# Altium schematic sheet Sch_Phy.SchDoc
size A4; ENG_APP_DATE: --/--/--; DSN_APP_DATE: --/--/--; CHK_APP_DATE: --/--/--; CompanyName: Universidade Federal de Santa Maria; Organization: Universidade Federal de Santa Maria; Address1: Av. Roraima 1000; Address2: Camobi; Address3: Santa Maria - RS; Address4: Brasil; SheetNumber: 4; SheetTotal: 6
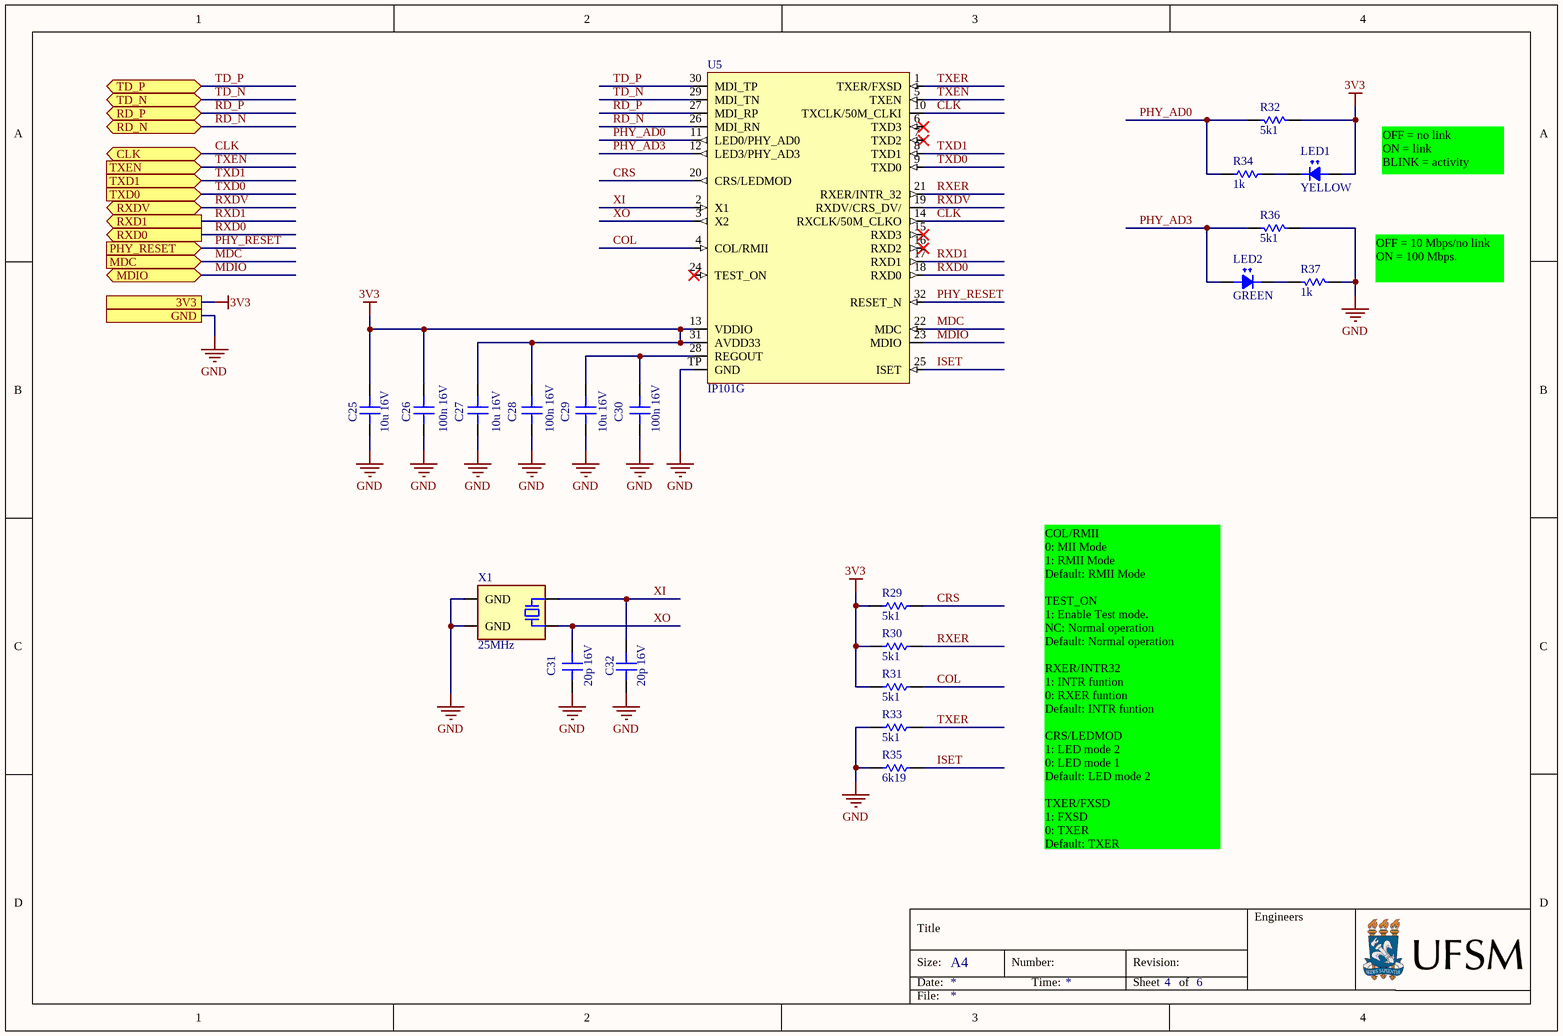
[diagram p0: Sch_Phy.SchDoc]

## Parts
C25  10u 16V  [CAP_SMD_0603]
C26  100n 16V  [CAP_SMD_0603]
C27  10u 16V  [CAP_SMD_0603]
C28  100n 16V  [CAP_SMD_0603]
C29  10u 16V  [CAP_SMD_0603]
C30  100n 16V  [CAP_SMD_0603]
C31  20p 16V  [CAP_SMD_0603]
C32  20p 16V  [CAP_SMD_0603]
LED1  YELLOW  [LED_SMD_0603]
LED2  GREEN  [LED_SMD_0603]
R29  5k1  [RES_SMD_0603]
R30  5k1  [RES_SMD_0603]
R31  5k1  [RES_SMD_0603]
R32  5k1  [RES_SMD_0603]
R33  5k1  [RES_SMD_0603]
R34  1k  [RES_SMD_0603]
R35  6k19  [RES_SMD_0603]
R36  5k1  [RES_SMD_0603]
R37  1k  [RES_SMD_0603]
U5  IP101G  [IC_QFN32_4x4]
X1  25MHz  [XTAL_SMD_3525]

## Ports
3V3, CLK (bidir), GND, MDC (in), MDIO (bidir), PHY_RESET (in), RD_N (bidir), RD_P (bidir), RXD0 (out), RXD1 (out), RXDV (bidir), TD_N (bidir), TD_P (bidir), TXD0 (in), TXD1 (in), TXEN (in)

## Nets
3V3: C25.1 C26.1 C27.1 C28.1 LED1.A R29.2 R30.2 R31.2 R32.2 U5.13(VDDIO) U5.31(AVDD33) ; port 3V3
GND: C25.2 C26.2 C27.2 C28.2 C29.2 C30.2 C31.2 C32.2 R33.2 R35.2 R36.2 R37.2 U5.TP(GND) X1.2(GND) X1.4(GND) ; port GND
CLK: U5.10(TXCLK/50M_CLKI) U5.14(RXCLK/50M_CLKO) ; port CLK
COL: R31.1 U5.4(COL/RMII)
CRS: R29.1 U5.20(CRS/LEDMOD)
ISET: R35.1 U5.25(ISET)
MDC: U5.22(MDC) ; port MDC
MDIO: U5.23(MDIO) ; port MDIO
PHY_AD0: R32.1 R34.2 U5.11(LED0/PHY_AD0)
PHY_AD3: LED2.A R36.1 U5.12(LED3/PHY_AD3)
PHY_RESET: U5.32(RESET_N) ; port PHY_RESET
RD_N: U5.26(MDI_RN) ; port RD_N
RD_P: U5.27(MDI_RP) ; port RD_P
RXD0: U5.18(RXD0) ; port RXD0
RXD1: U5.17(RXD1) ; port RXD1
RXDV: U5.19(RXDV/CRS_DV/) ; port RXDV
RXER: R30.1 U5.21(RXER/INTR_32)
TD_N: U5.29(MDI_TN) ; port TD_N
TD_P: U5.30(MDI_TP) ; port TD_P
TXD0: U5.9(TXD0) ; port TXD0
TXD1: U5.8(TXD1) ; port TXD1
TXEN: U5.5(TXEN) ; port TXEN
TXER: R33.1 U5.1(TXER/FXSD)
XI: C32.1 U5.2(X1) X1.3
XO: C31.1 U5.3(X2) X1.1
NetC29_1: C29.1 C30.1 U5.28(REGOUT)
NetLED1_K: LED1.K R34.1
NetLED2_K: LED2.K R37.1

Not connected (* = marked no-connect by the designer): U5 6(TXD3)* 7(TXD2)* 15(RXD3)* 16(RXD2)* 24(TEST_ON)*

## Notes on the sheet
- OFF = no link
  ON = link
  BLINK = activity
- (near R37) OFF = 10 Mbps/no link
  ON = 100 Mbps.
- COL/RMII
  0: MII Mode
  1: RMII Mode
  Default: RMII Mode
  TEST_ON
  1: Enable Test mode.
  NC: Normal operation
  Default: Normal operation
  RXER/INTR32
  1: INTR funtion
  0: RXER funtion
  Default: INTR funtion
  CRS/LEDMOD
  1: LED mode 2
  0: LED mode 1
  Default: LED mode 2
  TXER/FXSD
  1: FXSD
  0: TXER
  Default: TXER
- Engineers
- Title
- Size:
- Date:
- A4
- Number:
- Time:
- Revision:
- Sheet
- of
- File:

## Library data of the parts
C25-C32 = CAP_SMD: Capacitor SMD - Generic
LED1 LED2 = LED_SMD: LED SMD - Generic
R29-R37 = RES_SMD: Resistor SMD - Generic
U5 = IC_IP101G: Single Port 10/100 MII/RMII/TP/Fiber Fast Ethernet Transceiver
X1 = XTAL_SMD_GND: SMD Crystal with GND - Generic